# Altium schematic sheet LPGDetA1_main.SchDoc
size A4; DocumentNumber: 1; SheetNumber: 1; SheetTotal: 6; Subtitle0: Schemat glowny; LotOfPieces: 1
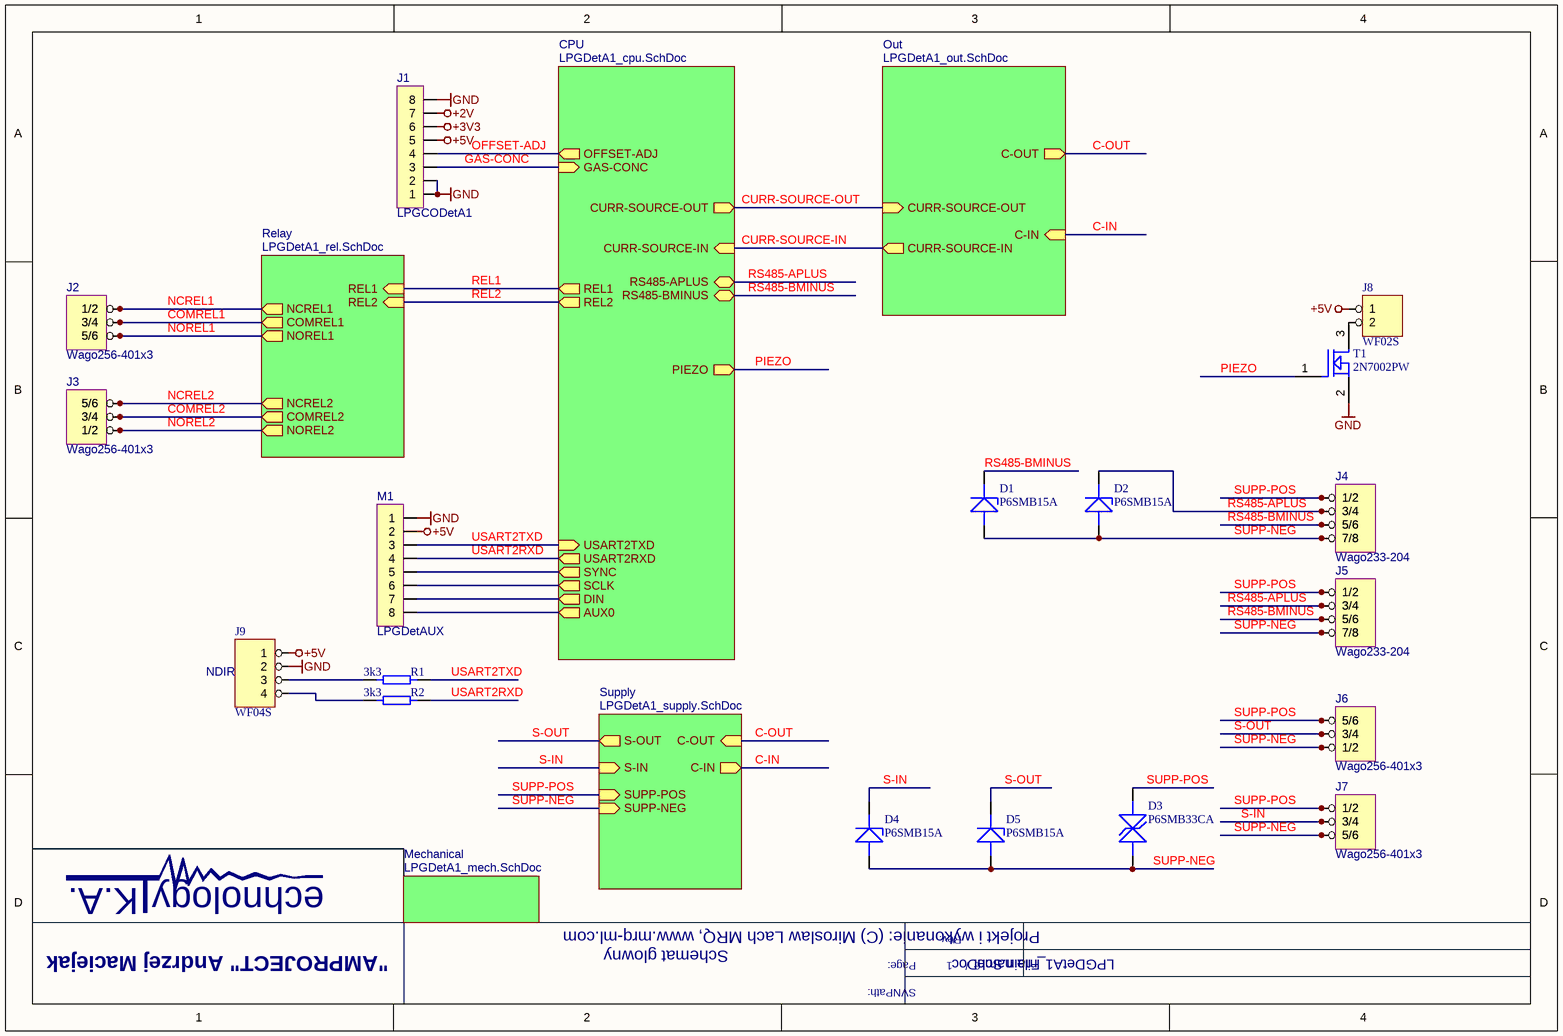
[diagram p0: LPGDetA1_main.SchDoc]

## Parts
?  (no value)
D1  P6SMB15A  [SMB]
D2  P6SMB15A  [SMB]
D3  P6SMB33CA  [DO-214AA]
D4  P6SMB15A  [SMB]
D5  P6SMB15A  [SMB]
J1  LPGCODetA1  [LPGCODetA1]
J2  Wago256-401x3  [WAGO256-401x3]
J3  Wago256-401x3  [WAGO256-401x3]
J4  Wago233-204  [Wago233-204]
J5  Wago233-204  [Wago233-204]
J6  Wago256-401x3  [WAGO256-401x3]
J7  Wago256-401x3  [WAGO256-401x3]
J8  WF02S  [WF02S]
J9  WF04S  [WF04S]
M1  LPGDetAUX  [LPGDETAUX]
R1  OtherParams: 3k3  [0805]  (hidden comment: 0805WAJ 3K3 T5E)
R2  OtherParams: 3k3  [0805]  (hidden comment: 0805WAJ 3K3 T5E)
T1  2N7002PW  [SOT323-3_FLOW]

## Sub-sheets
CPU = LPGDetA1_cpu.SchDoc: OFFSET-ADJ, GAS-CONC, CURR-SOURCE-OUT, CURR-SOURCE-IN, RS485-APLUS, RS485-BMINUS, REL1, REL2, USART2TXD, USART2RXD, SYNC, SCLK, DIN, AUX0, PIEZO
Mechanical = LPGDetA1_mech.SchDoc: no entries
Out = LPGDetA1_out.SchDoc: CURR-SOURCE-OUT, C-OUT, C-IN, CURR-SOURCE-IN
Relay = LPGDetA1_rel.SchDoc: REL1, REL2, COMREL1, COMREL2, NOREL1, NOREL2, NCREL1, NCREL2
Supply = LPGDetA1_supply.SchDoc: SUPP-POS, SUPP-NEG, S-OUT, S-IN, C-IN, C-OUT

## Nets
+2V: J1.7
+3V3: J1.6
+5V: J1.5 J8.1 J9.1 M1.2
GND: J1.1 J1.2 J1.8 J9.2 M1.1 T1.2(SOURCE)
C-IN: sheet Supply/C-IN, sheet Out/C-IN
C-OUT: sheet Supply/C-OUT, sheet Out/C-OUT
COMREL1: J2.3(3/4) J2.4(3/4) ; sheet Relay/COMREL1
COMREL2: J3.3(3/4) J3.4(3/4) ; sheet Relay/COMREL2
CURR-SOURCE-IN: sheet CPU/CURR-SOURCE-IN, sheet Out/CURR-SOURCE-IN
CURR-SOURCE-OUT: sheet CPU/CURR-SOURCE-OUT, sheet Out/CURR-SOURCE-OUT
GAS-CONC: J1.3 ; sheet CPU/GAS-CONC
NCREL1: J2.1(1/2) J2.2(1/2) ; sheet Relay/NCREL1
NCREL2: J3.5(5/6) J3.6(5/6) ; sheet Relay/NCREL2
NOREL1: J2.5(5/6) J2.6(5/6) ; sheet Relay/NOREL1
NOREL2: J3.1(1/2) J3.2(1/2) ; sheet Relay/NOREL2
OFFSET-ADJ: J1.4 ; sheet CPU/OFFSET-ADJ
PIEZO: T1.1(GATE) ; sheet CPU/PIEZO
REL1: sheet CPU/REL1, sheet Relay/REL1
REL2: sheet CPU/REL2, sheet Relay/REL2
RS485-APLUS: D2.CATH J4.3(3/4) J4.4(3/4) J5.3(3/4) J5.4(3/4) ; sheet CPU/RS485-APLUS
RS485-BMINUS: D1.CATH J4.5(5/6) J4.6(5/6) J5.5(5/6) J5.6(5/6) ; sheet CPU/RS485-BMINUS
S-IN: D4.CATH J7.3(3/4) J7.4(3/4) ; sheet Supply/S-IN
S-OUT: D5.CATH J6.3(3/4) J6.4(3/4) ; sheet Supply/S-OUT
SUPP-NEG: D1.ANOD D2.ANOD D3.ANOD D4.ANOD D5.ANOD J4.7(7/8) J4.8(7/8) J5.7(7/8) J5.8(7/8) J6.1(1/2) J6.2(1/2) J7.5(5/6) J7.6(5/6) ; sheet Supply/SUPP-NEG
SUPP-POS: D3.CATH J4.1(1/2) J4.2(1/2) J5.1(1/2) J5.2(1/2) J6.5(5/6) J6.6(5/6) J7.1(1/2) J7.2(1/2) ; sheet Supply/SUPP-POS
USART2RXD: M1.4 R2.2 ; sheet CPU/USART2RXD
USART2TXD: M1.3 R1.2 ; sheet CPU/USART2TXD
NetJ8_2: J8.2 T1.3(DRAIN)
NetJ9_3: J9.3 R1.1
NetJ9_4: J9.4 R2.1
NetM1_5: M1.5 ; sheet CPU/SYNC
NetM1_6: M1.6 ; sheet CPU/SCLK
NetM1_7: M1.7 ; sheet CPU/DIN
NetM1_8: M1.8 ; sheet CPU/AUX0

## Notes on the sheet
- (near J9) NDIR
- K.A.
- echnology
- Projekt i wykonanie: (C) Miroslaw Lach MRQ, www.mrq-ml.com
- "AMPROJECT" Andrzej Maciejak
- SVNPath:
- Page:
- Rev.
- /
- File name:

## Library data of the parts
? = KATECHNOLOGYLOGO
D1 D2 D4 D5 = P6SMB15A[[/\]]SMB: Descript: Transient Suppresion Unidirectional Diode 15V 600W, case SMB; Reference5: P6SMB15A-LF; Currency5: PLZ; Amount5: 3+; Value: P6SMB15A; Dimensions: SMB; ComponentLink1Description: Datasheet; ComponentLink1URL: http://www.mrq-ml.com/Parts/Diodes/Littelfuse_TVS-Diodes_P6SMB.pdf; Supplier5: tme.pl; Manufacturer5: Littelfuse; Typ5: P6SMB15A; Price5: 0,7; DateOfPrice5: 2012-09-30; Price1: 0,48
D3 = P6SMB33CA[[/\]]SMB: Descript: Transient Suppresion Bidirectional Diode 40.7V 600W, case SMB; Currency5: PLN; Amount5: 3+; Value: P6SMB33CA; Dimensions: SMB; ComponentLink1Description: Datasheet; ComponentLink1URL: http://www.mrq-ml.com/Parts/Diodes/Littelfuse_TVS-Diodes_P6SMB.pdf; Supplier5: tme.pl; Reference5: P6SMB33CA; Manufacturer5: Semikron; Typ5: P6SMB33CA; Price5: 0,7; DateOfPrice5: 2012-11-24; Price1: 0,389
J1 = LPGCODetA1[[/\]]LPGCODetA1: Descript: Modul czujnika CO/LPG; Reference5: mlach; Value: LPGCODetA1; Dimensions: LPGCODetA1; Supplier5: modu³ LPGCODetA1
J2 J3 J6 J7 = Wago256-401x3[[/\]]15x15: Descript: z彻czka do p硑tek drukowanych 45� 2,5mm2 16A RM5 1P/2pin szary, 3 tory plus scianka; Reference5: 256-401 (3szt.) +256-100(1szt.); Typ5: 256-401x3, 256-100; Currency5: PLN; Amount5: 10+; Value: Wago256-401x3; Dimensions: 15x15; Supplier5: soselectronic.pl; Manufacturer5: Wago; Price5: 2,8278; DateOfPrice5: 2012-11-24; Price1: 2,3056
J4 J5 = Wago233-204[[/\]]13.9x12.3: Descript: PCB terminal strip with push buttons 0.5mm2; Currency5: PLN; Amount5: 2+; Value: Wago233-204; Dimensions: 13.9x12.3; ComponentLink1Description: Datasheet; ComponentLink1URL: http://www.mrq-ml.com/Parts/Connectors/Wago233-204.pdf; Supplier5: soselectronic.pl; Reference5: 233-204; Manufacturer5: Wago; Typ5: 233-204; Price5: 4,078; DateOfPrice5: 2012-11-24; Price1: 3,2542
J8 = WF02S[[/\]]WF02S: Descript: connector 2,54 pitch, SMD, 2 pole, straight, male; Reference5: WF02S-LF; Currency5: PLZ; Amount5: 10+; Value: WF02S; Dimensions: WF02S; ComponentLink1Description: Datasheet; ComponentLink1URL: http://www.mrq-ml.com/Parts/Connectors/WFXXS.pdf; Supplier5: maritex.com.pl; Price5: 0,029; DateOfPrice5: 2012-09-18
J9 = WF04S[[/\]]WF04S: Descript: connector 2.54mm pitch, THT, 4 pole, straight, male; Reference5: WF04S-JS; Currency5: PLN; Amount5: 10+; Value: WF04S; Dimensions: WF04S; ComponentLink1Description: Datasheet; ComponentLink1URL: http://www.mrq-ml.com/Parts/Connectors/WFXXS.pdf; Supplier5: maritex.com.pl; Price5: 0,069; DateOfPrice5: 2012-07-11
M1 = LPGDetAUX[[/\]]LPGDetAUX: Descript: Dodatkowy modul do LPGDet; Value: LPGDetAUX; Dimensions: LPGDetAUX
R1 R2 = 0805WAJ 3K3 T5E[[/\]]0805[[/\]]0.125W[[/\]]5%[[/\]]3k3: DissPower: 0.125W; Tolerance: 5%; Descript: Resistor 3.3kohm, 0.125W, 5%, 0805; Reference5: SMD0805-3K3; Currency5: PLN; Amount5: 100+; Value: 0805WAJ 3K3 T5E; Dimensions: 0805; ComponentLink1Description: Datasheet; ComponentLink1URL: http://www.mrq-ml.com/Parts/Resistors/RoyalOhm_rezystor-smd.pdf; Supplier5: tme.pl; Manufacturer5: Royal Ohm; Typ5: 0805WAJ 3K3 T5E; Price5: 0,025; DateOfPrice5: 2012-09-18
T1 = 2N7002PW[[/\]]SOT323-3: Descript: N-channel enhacement-mode vertical DMOS FET; Reference5: 1829184; Currency5: PLN; Amount5: 1+; Value: 2N7002PW; Dimensions: SOT323-3; ComponentLink1Description: Datasheet; ComponentLink1URL: http://www.mrq-ml.com/Parts/Transistors/2N7002PW.pdf; Supplier5: farnell.com; Manufacturer5: NXP; Typ5: 2N7002PW; Price5: 0,17; DateOfPrice5: 2012-09-19; Price1: 0,14